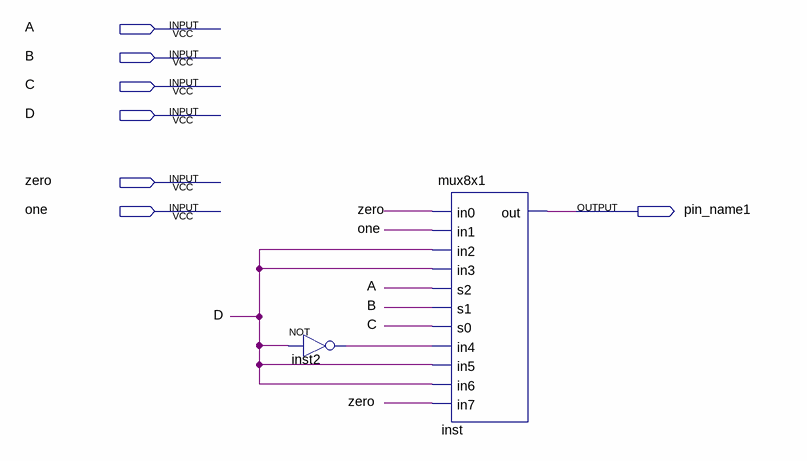
[diagram p0: schematic sheet]
// Quartus schematic q5.bdf as structural Verilog: 2 symbols, 7 pins
module q5 (
  input  A,
  input  B,
  input  C,
  input  D,
  input  zero,
  input  one,
  output pin_name1
);

  wire inst2_out;

  not inst2 (inst2_out, D);
  mux8x1 inst (
    .in0(zero), .in1(one), .in2(D), .in3(D), .s2(A), .s1(B), .s0(C), .in4(inst2_out), .in5(D), .in6(D),
    .in7(zero), .out(pin_name1));
endmodule
